# EAGLE schematic tim_encoder (EAGLE 7.7.0)
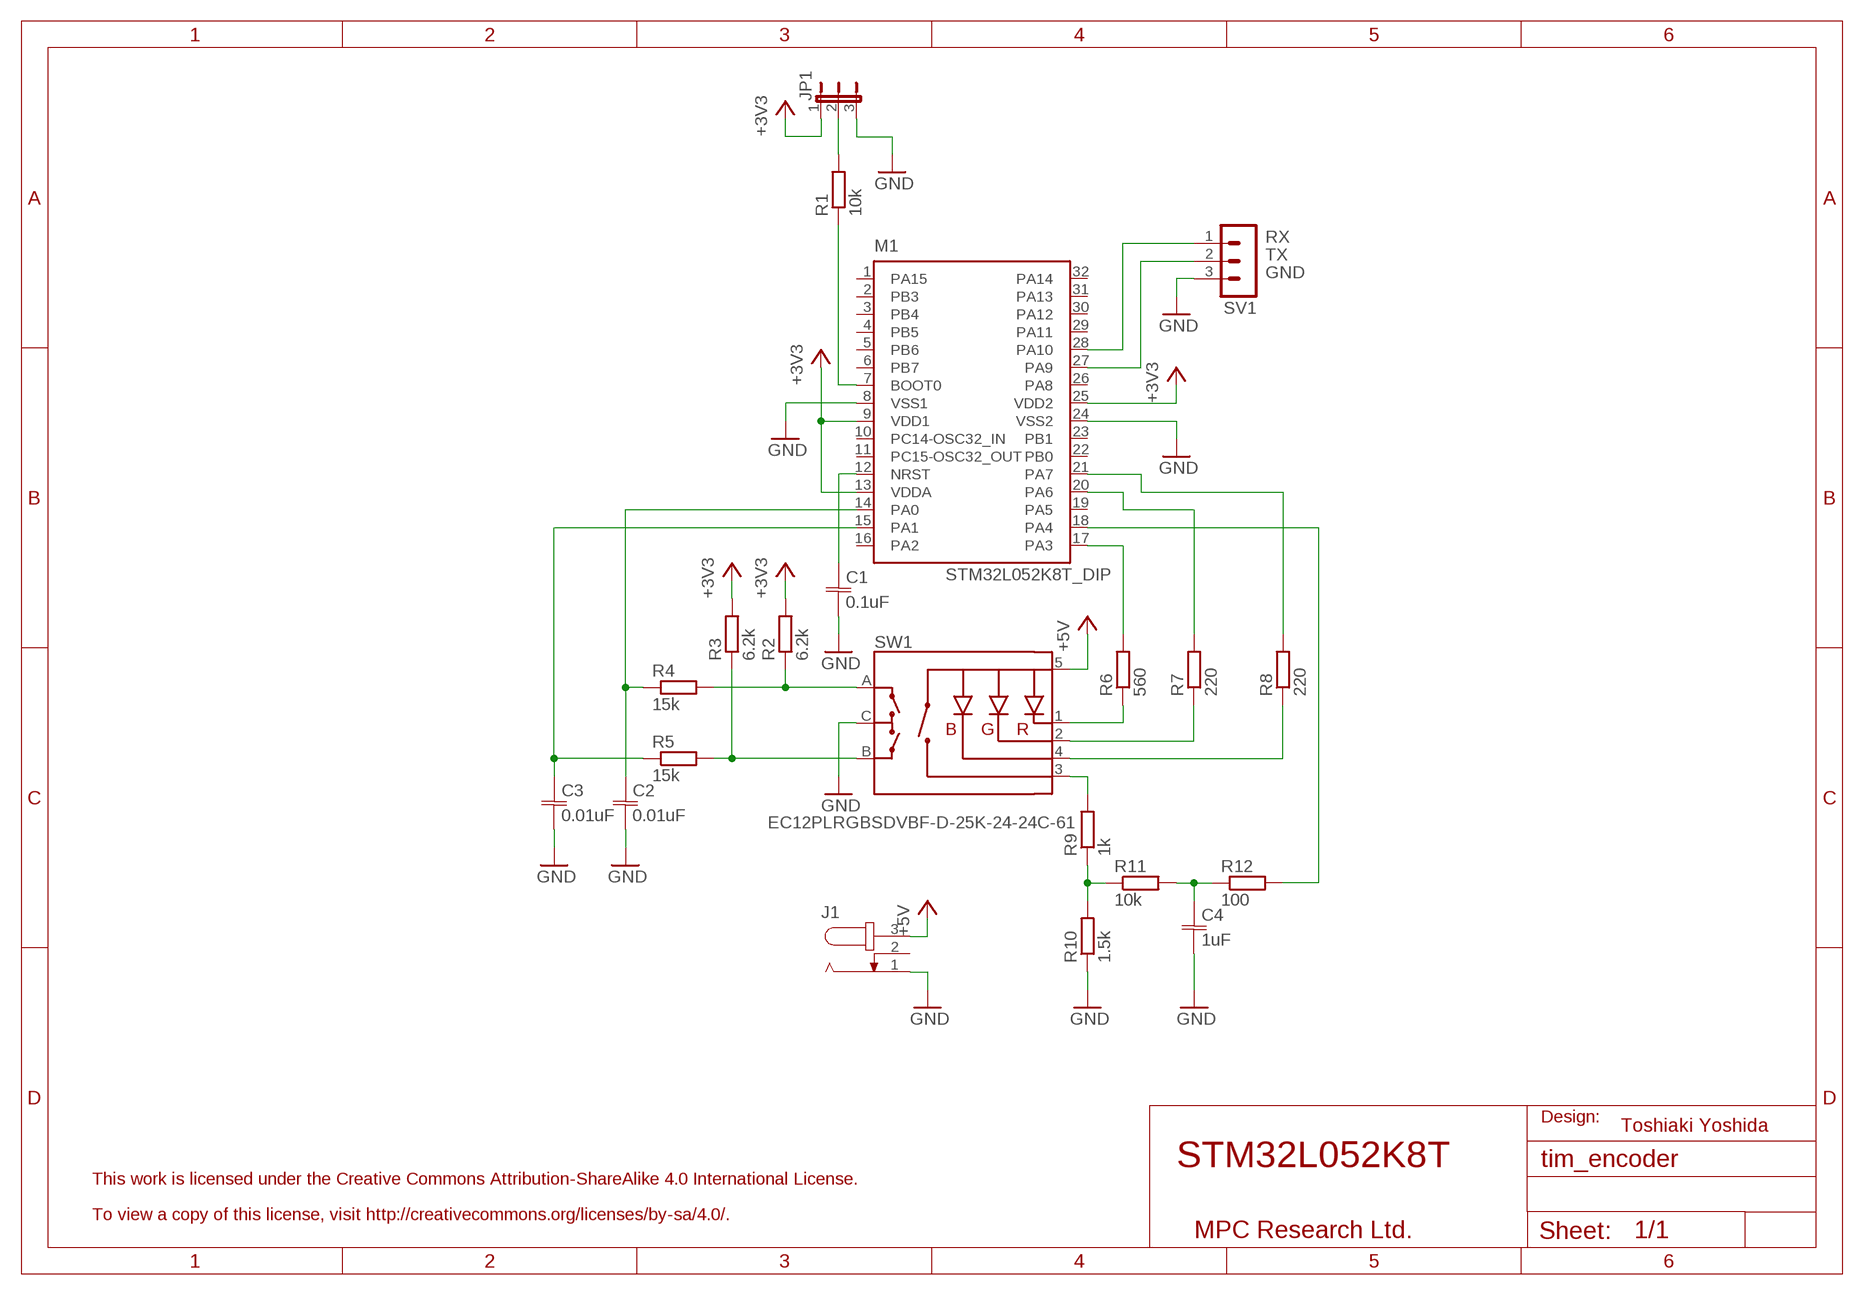
[diagram p0: schematic, sheet 1]

## Parts
C1  0.1uF  C-JIS050-024X044  [C050-024X044]
C2  0.01uF  C-JIS050-024X044  [C050-024X044]
C3  0.01uF  C-JIS050-024X044  [C050-024X044]
C4  1uF  C-JIS050-024X044  [C050-024X044]
J1  JACK-PLUG0  [SPC4077]
JP1  JP2E  [JP2]
M1  STM32L052K8T_DIP  [DIP32]
R1  10k  R-EU_0207/2V  [0207/2V]
R2  6.2k  R-EU_0207/2V  [0207/2V]
R3  6.2k  R-EU_0207/2V  [0207/2V]
R4  15k  R-EU_0207/2V  [0207/2V]
R5  15k  R-EU_0207/2V  [0207/2V]
R6  560  R-EU_0207/2V  [0207/2V]
R7  220  R-EU_0207/2V  [0207/2V]
R8  220  R-EU_0207/2V  [0207/2V]
R9  1k  R-EU_0207/2V  [0207/2V]
R10  1.5k  R-EU_0207/2V  [0207/2V]
R11  10k  R-EU_0207/2V  [0207/2V]
R12  100  R-EU_0207/2V  [0207/2V]
SV1  MA03-1  [MA03-1]
SW1  EC12PLRGBSDVBF-D-25K-24-24C-61  ENCODER_RGB_CA  [ENCODER_LED_3]

## Nets
+3V3: JP1.1 M1.9(VDD1) M1.13(VDDA) M1.25(VDD2) R2.2 R3.2
+5V: J1.3 SW1.5(+)
GND: C1.2 C2.2 C3.2 C4.2 J1.1 JP1.3 M1.8(VSS1) M1.24(VSS2) R10.1 SV1.3 SW1.C
N$1: M1.27(PA9) SV1.2
N$2: M1.7(BOOT0) R1.1
N$3: M1.28(PA10) SV1.1
N$4: C1.1 M1.12(NRST)
N$5: R2.1 R4.2 SW1.A
N$6: JP1.2 R1.2
N$7: C2.1 M1.14(PA0) R4.1
N$8: R3.1 R5.2 SW1.B
N$9: C3.1 M1.15(PA1) R5.1
N$10: M1.17(PA3) R6.2
N$11: R6.1 SW1.1(-R)
N$12: R7.1 SW1.2(-G)
N$13: M1.20(PA6) R7.2
N$14: M1.21(PA7) R8.2
N$15: R8.1 SW1.4(-B)
N$16: R9.2 SW1.3(SW)
N$17: R9.1 R10.2 R11.1
N$18: C4.1 R11.2 R12.1
N$19: M1.18(PA4) R12.2
Unconnected: J1.2 M1.1(PA15) M1.2(PB3) M1.3(PB4) M1.4(PB5) M1.5(PB6) M1.6(PB7) M1.10(PC14-OSC32_IN) M1.11(PC15-OSC32_OUT) M1.16(PA2) M1.19(PA5) M1.22(PB0) M1.23(PB1) M1.26(PA8) M1.29(PA11) M1.30(PA12) M1.31(PA13) M1.32(PA14)

## Notes on the sheet
- RX
- TX
- GND
- Design:
- Toshiaki Yoshida
- STM32L052K8T
- This work is licensed under the Creative Commons Attribution-ShareAlike 4.0 International License.
- To view a copy of this license, visit http://creativecommons.org/licenses/by-sa/4.0/.
- MPC Research Ltd.

## Library data of the parts
C1-C4 = cap:C-JIS: CAPACITOR, Japanese symbol
J1 = con-jack:JACK-PLUG: DC POWER JACK Power Jack, DC, Right Angle, Through Hole, Rated 5A at 16VDC, PC Terminals Distributor: Farnell (www.Farnell.de) Drawing: 84N1161.pdf / 84N1162.pdf Manufacturer: SPC Technology (www.spctechnology.com) Type: SPC4077 / SPC 4078; OC_FARNELL: unknown; OC_NEWARK: unknown
JP1 = jumper:JP2E: JUMPER
M1 = stm32:STM32L052K8T_DIP
R1-R12 = resistor:R-EU_: RESISTOR, European symbol
SV1 = con-lstb:MA03-1: PIN HEADER; OC_FARNELL: unknown; OC_NEWARK: unknown
SW1 = SparkFun-Electromechanical:ENCODER_RGB_CA: Illuminated Rotary Encoder w/ RGB LED and select switch EC12PLRGBSDVBF-D: http://top-up.so-buy.com/front/bin/ptdetail.phtml?Part=EC12PLRGBSDVBF-D